# EAGLE schematic electic_sk (EAGLE 9.6.2)
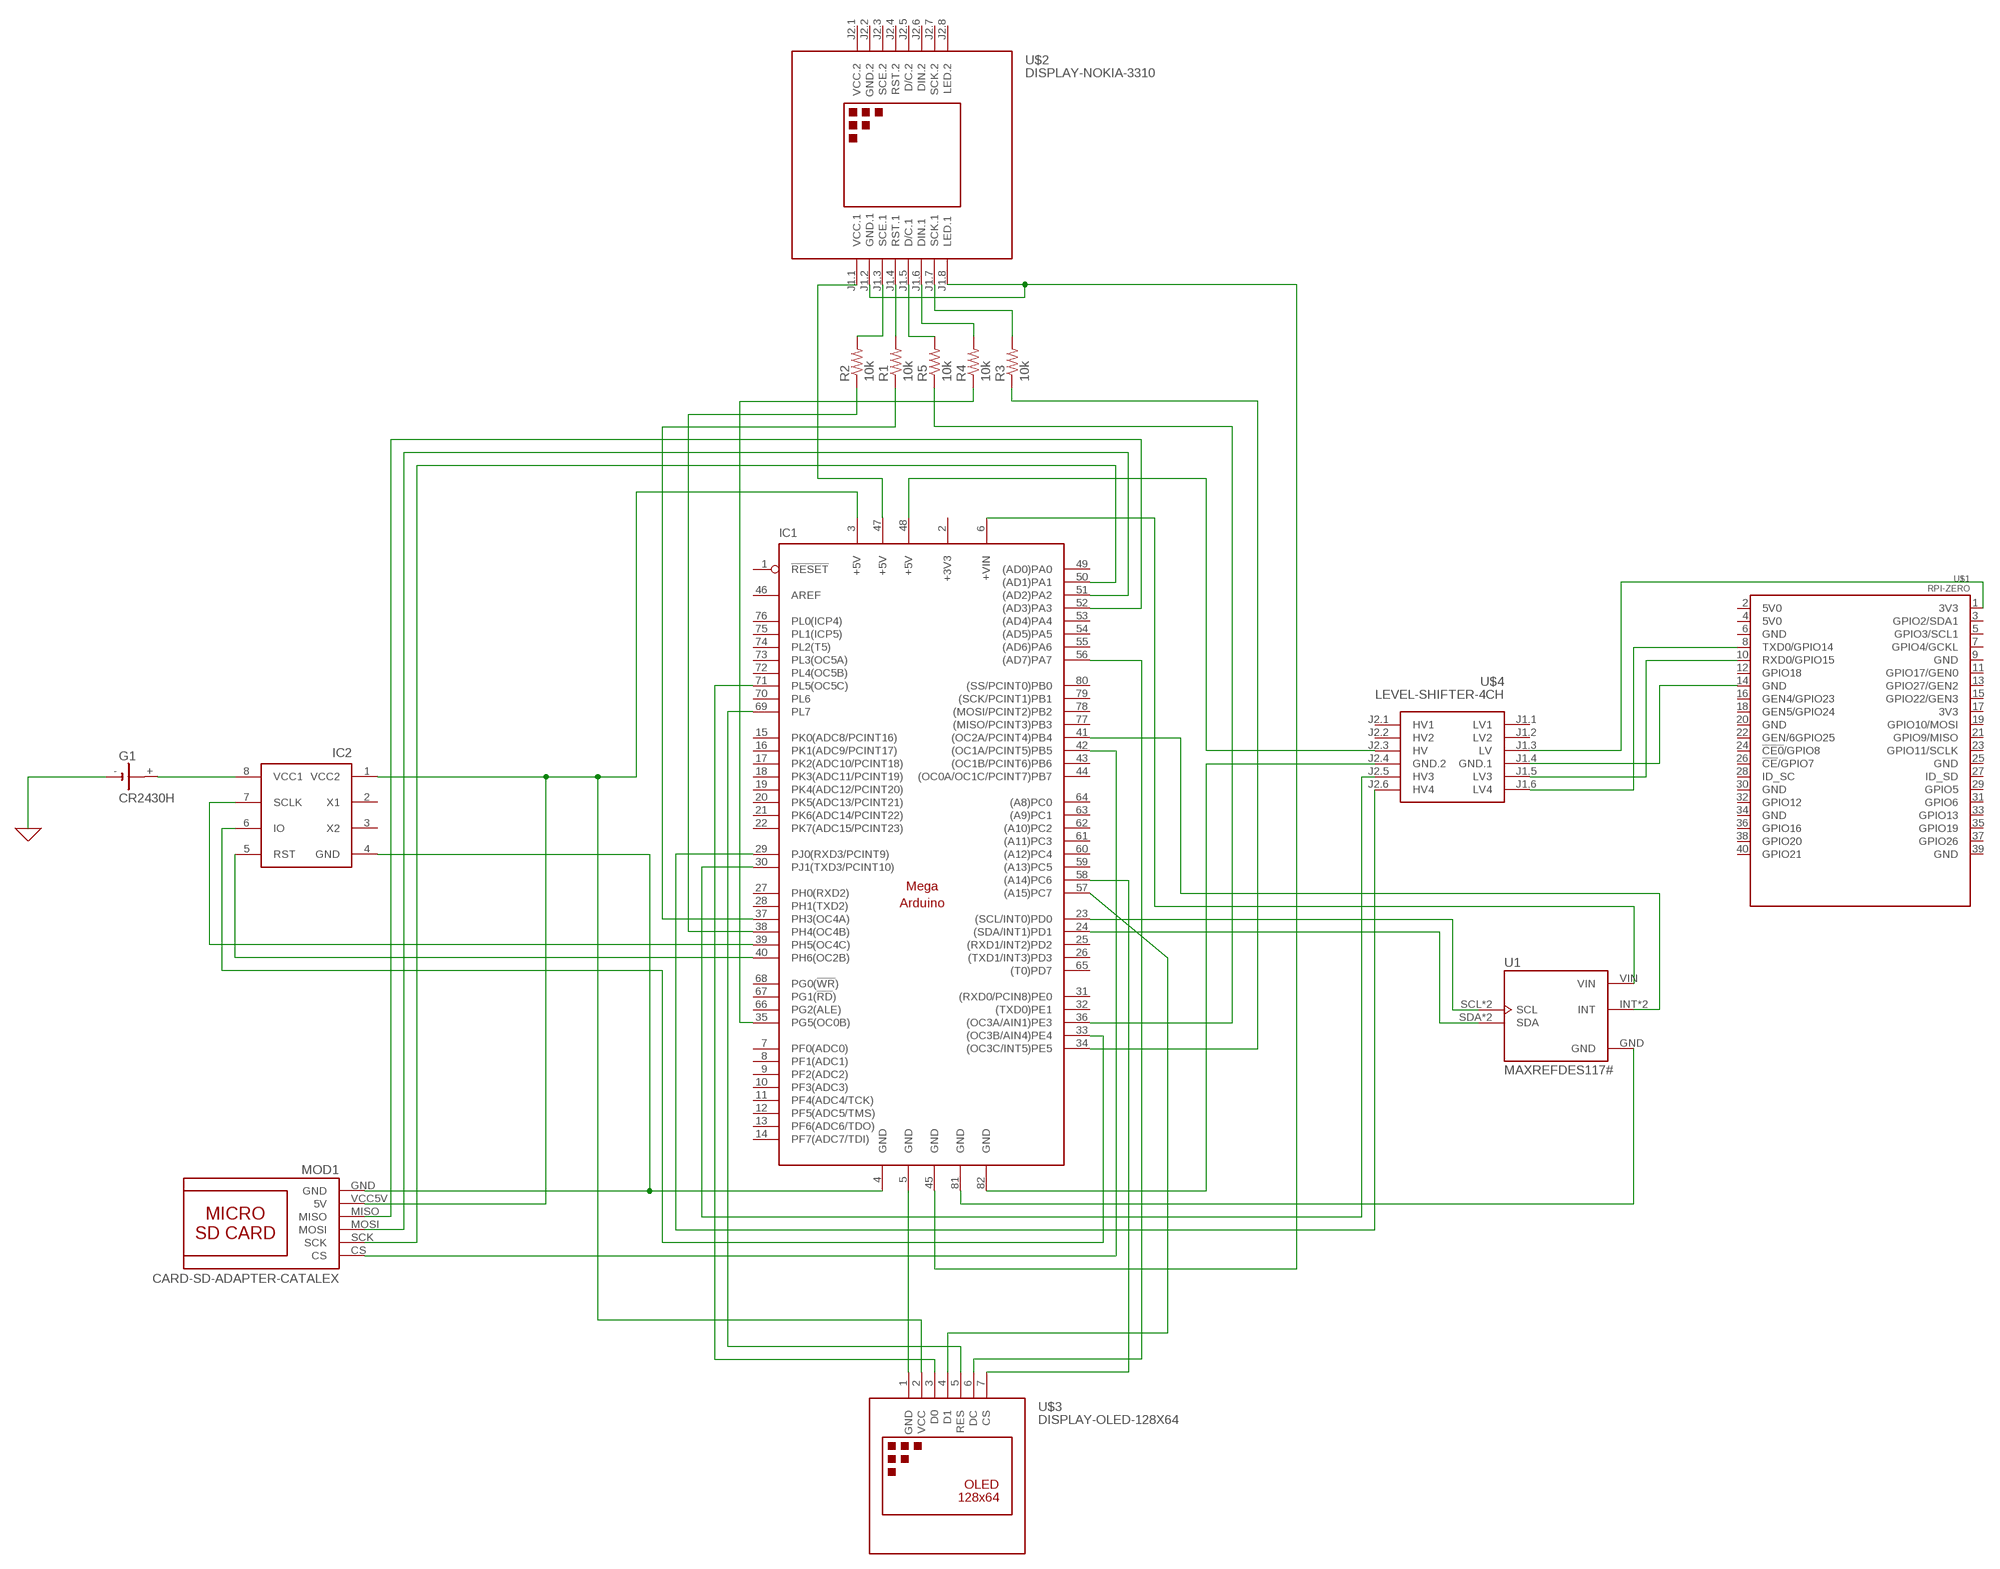
[diagram p0: schematic, sheet 1]

## Parts
G1  CR2430H  [CR2430H]
IC1  MEGAARDUINO_1  [MEGA_ARDUINO]
IC2  DS1302  [PDIP8]
MOD1  CARD-SD-ADAPTER-CATALEX  [CARD-SD-ADAPTER-CATALEX]
R1  10k  R-US_0204/2V  [0204V]
R2  10k  R-US_0204/2V  [0204V]
R3  10k  R-US_0204/2V  [0204V]
R4  10k  R-US_0204/2V  [0204V]
R5  10k  R-US_0204/2V  [0204V]
U1  MAXREFDES117#  [MODULE_MAXREFDES117#]
U$1  RPI-ZERO  [RASPBERRYPI_BASTELSTUBE_V13_RASPI_BOARD_B+_FULL]
U$2  DISPLAY-NOKIA-3310  [DISPLAY-NOKIA-3310]
U$3  DISPLAY-OLED-128X64  [DISPLAY-OLED-128X64]
U$4  LEVEL-SHIFTER-4CH  [LEVEL-SHIFTER-4CH]

## Nets
0: G1.- ; supply symbol labelled GND
3V3@1: U$1.1(3V3) U$4.J1.3(LV)
GND@4: U$1.14(GND) U$4.J1.4(GND.1)
N$1: U$1.10(RXD0/GPIO15) U$4.J1.5(LV3)
N$2: U$1.8(TXD0/GPIO14) U$4.J1.6(LV4)
N$3: IC1.48(+5V) U$4.J2.3(HV)
N$4: IC1.82(GND) U$4.J2.4(GND.2)
N$5: IC1.29(PJ0(RXD3/PCINT9)) U$4.J2.6(HV4)
N$6: IC1.30(PJ1(TXD3/PCINT10)) U$4.J2.5(HV3)
N$7: IC1.23((SCL/INT0)PD0) U1.SCL U1.SCL1(SCL)
N$8: IC1.24((SDA/INT1)PD1) U1.SDA U1.SDA1(SDA)
N$9: IC1.6(+VIN) U1.VIN
N$10: IC1.41((OC2A/PCINT4)PB4) U1.INT U1.INT1(INT)
N$11: IC1.81(GND) U1.GND
N$12: G1.+ IC2.8(VCC1)
N$13: IC1.40(PH6(OC2B)) IC2.5(RST)
N$14: IC1.33((OC3B/AIN4)PE4) IC2.6(IO)
N$15: IC1.4(GND) IC2.4(GND) MOD1.GND
N$16: IC1.39(PH5(OC4C)) IC2.7(SCLK)
N$17: IC1.3(+5V) IC2.1(VCC2) MOD1.VCC5V(5V) U$3.2(VCC)
N$18: IC1.42((OC1A/PCINT5)PB5) MOD1.CS
N$19: IC1.50((AD1)PA1) MOD1.SCK
N$20: IC1.51((AD2)PA2) MOD1.MOSI
N$21: IC1.52((AD3)PA3) MOD1.MISO
N$22: IC1.58((A14)PC6) U$3.7(CS)
N$23: IC1.56((AD7)PA7) U$3.6(DC)
N$24: IC1.69(PL7) U$3.5(RES)
N$25: IC1.57((A15)PC7) U$3.4(D1)
N$26: IC1.71(PL5(OC5C)) U$3.3(D0)
N$27: R1.2 U$2.J1.4(RST.1)
N$28: IC1.5(GND) U$3.1(GND)
N$29: R2.2 U$2.J1.3(SCE.1)
N$30: R5.2 U$2.J1.5(D/C.1)
N$31: R4.2 U$2.J1.6(DIN.1)
N$32: R3.2 U$2.J1.7(SCK.1)
N$33: IC1.38(PH4(OC4B)) R2.1
N$34: IC1.37(PH3(OC4A)) R1.1
N$35: IC1.36((OC3A/AIN1)PE3) R5.1
N$36: IC1.35(PG5(OC0B)) R4.1
N$37: IC1.34((OC3C/INT5)PE5) R3.1
N$38: IC1.45(GND) U$2.J1.2(GND.1) U$2.J1.8(LED.1)
N$40: IC1.47(+5V) U$2.J1.1(VCC.1)
Unconnected: G1.+@1(+) IC1.1(!RESET) IC1.7(PF0(ADC0)) IC1.8(PF1(ADC1)) IC1.9(PF2(ADC2)) IC1.10(PF3(ADC3)) IC1.11(PF4(ADC4/TCK)) IC1.12(PF5(ADC5/TMS)) IC1.13(PF6(ADC6/TDO)) IC1.14(PF7(ADC7/TDI)) IC1.15(PK0(ADC8/PCINT16)) IC1.16(PK1(ADC9/PCINT17)) IC1.17(PK2(ADC10/PCINT18)) IC1.18(PK3(ADC11/PCINT19)) IC1.19(PK4(ADC12/PCINT20)) IC1.20(PK5(ADC13/PCINT21)) IC1.21(PK6(ADC14/PCINT22)) IC1.22(PK7(ADC15/PCINT23)) IC1.25((RXD1/INT2)PD2) IC1.26((TXD1/INT3)PD3) IC1.27(PH0(RXD2)) IC1.28(PH1(TXD2)) IC1.31((RXD0/PCIN8)PE0) IC1.32((TXD0)PE1) IC1.43((OC1B/PCINT6)PB6) IC1.44((OC0A/OC1C/PCINT7)PB7) IC1.46(AREF) IC1.49((AD0)PA0) IC1.53((AD4)PA4) IC1.54((AD5)PA5) IC1.55((AD6)PA6) IC1.59((A13)PC5) IC1.60((A12)PC4) IC1.61((A11)PC3) IC1.62((A10)PC2) IC1.63((A9)PC1) IC1.64((A8)PC0) IC1.65((T0)PD7) IC1.66(PG2(ALE)) IC1.67(PG1(!RD!)) IC1.68(PG0(!WR!)) IC1.70(PL6) IC1.72(PL4(OC5B)) IC1.73(PL3(OC5A)) IC1.74(PL2(T5)) IC1.75(PL1(ICP5)) IC1.76(PL0(ICP4)) IC1.77((MISO/PCINT3)PB3) IC1.78((MOSI/PCINT2)PB2) IC1.79((SCK/PCINT1)PB1) IC1.80((SS/PCINT0)PB0) IC2.2(X1) IC2.3(X2) U$1.2(5V0) U$1.3(GPIO2/SDA1) U$1.4(5V0) U$1.5(GPIO3/SCL1) U$1.6(GND) U$1.7(GPIO4/GCKL) U$1.9(GND) U$1.11(GPIO17/GEN0) U$1.12(GPIO18) U$1.13(GPIO27/GEN2) U$1.15(GPIO22/GEN3) U$1.16(GEN4/GPIO23) U$1.17(3V3) U$1.18(GEN5/GPIO24) U$1.19(GPIO10/MOSI) U$1.20(GND) U$1.21(GPIO9/MISO) U$1.22(GEN/6GPIO25) U$1.23(GPIO11/SCLK) U$1.24(!CE0!/GPIO8) U$1.25(GND) U$1.26(!CE!/GPIO7) U$1.27(ID_SD) U$1.28(ID_SC) U$1.29(GPIO5) U$1.30(GND) U$1.31(GPIO6) U$1.32(GPIO12) U$1.33(GPIO13) U$1.34(GND) U$1.35(GPIO19) U$1.36(GPIO16) U$1.37(GPIO26) U$1.38(GPIO20) U$1.39(GND) U$1.40(GPIO21) U$2.J2.3(SCE.2) U$2.J2.4(RST.2) U$2.J2.5(D/C.2) U$2.J2.6(DIN.2) U$2.J2.7(SCK.2) U$2.J2.8(LED.2) U$4.J1.1(LV1) U$4.J1.2(LV2) U$4.J2.1(HV1) U$4.J2.2(HV2)

## Power pins joined to a net without a drawn wire
+3V3: IC1.2(+3V3)
GND.2: U$2.J2.2(GND.2)
VCC.2: U$2.J2.1(VCC.2)

## Library data of the parts
G1 = battery:CR2430H: LI BATTERY Varta
IC1 = arduino:MEGAARDUINO_1: The Arduino Mega is a microcontroller board based on the ATmega1280. - 54 digital input/output pins (of which 14 can be used as PWM outputs) - 16 analog inputs - 4 UARTs (hardware serial ports) - 16 MHz crystal oscillator - USB connection - power jack - ICSP header - reset button It contains everything needed to support the microcontroller; simply connect it to a computer with a USB cable or power it with a AC-to-DC adapter or battery to get started. The Mega is compatible with most shields designed for the Arduino Duemilanove or Diecimila. http://arduino.cc/en/Main/ArduinoBoardMega
IC2 = ltc1440_lt1529_ds1302:DS1302: DS1302 Realtime Clock The DS1302 trickle-charge timekeeping chip contains a real-time clock/calendar and 31 bytes of static RAM. It communicates with a microprocessor via a simple serial interface. The real-time clock/calendar provides seconds, minutes, hours, day, date, month, and year information. The end of the month date is automatically adjusted for months with fewer than 31 days, including corrections for leap year. The clock operates in either the 24-hour or 12-hour format with an AM/PM indicator. Interfacing the DS1302 with a microprocessor is simplified by using synchronous serial communication. Only three wires are required to communicate with the clock/RAM: CE, I/O (data line), and SCLK (serial clock). Data can be transferred to and from the clock/RAM 1 byte at a time or in a burst of up to 31 bytes. The DS1302 is designed to operate on very low power and retain data and clock information on less than 1µW. The DS1302 is the successor to the DS1202. In addition to the basic timekeeping functions of the DS1202, the DS1302 has the additional features of dual power pins for primary and backup power supplies, programmable trickle charger for VCC1, and seven additional bytes of scratchpad memory.
MOD1 = SD-Card-Module_CATALEX:CARD-SD-ADAPTER-CATALEX: Micro SD Card Adapter Module with onboard 3.3V regulator
R1-R5 = rcl:R-US_: RESISTOR, American symbol; SPICEPREFIX: R
U1 = MAXREFDES117_:MAXREFDES117#: MAX1921, MAX14595, MAX30102 - Medical, Pulse Oximeter (PO or SpO2) Sensor Evaluation Board Check prices <https://pricing.snapeda.com/parts/MAXREFDES117%23/Maxim%20Integrated/view-part?ref=eda>; AVAILABILITY: In Stock; DESCRIPTION: MAX1921, MAX14595, MAX30102 - Medical, Pulse Oximeter (PO or SpO2) Sensor Evaluation Board; MF: Maxim Integrated; MP: MAXREFDES117#; PACKAGE: None; PRICE: None
U$1 = RPI-Zero:RPI-ZERO
U$2 = diy-modules:DISPLAY-NOKIA-3310: 84x48 Dot Matrix LCD Module based on Nokia 3310 display More details available here: https://arduinoandsoftware.wordpress.com/2012/12/30/nokia-33105110-3-3v-display-with-5v-arduino/
U$3 = diy-modules:DISPLAY-OLED-128X64: 128x64 Dot Matrix OLED Module based on SSD1306 chip Variant with SPI interface More details available here: http://www.instructables.com/id/How-to-use-OLED-display-arduino-module/ SSD1306 datasheet: https://cdn-shop.adafruit.com/datasheets/SSD1306.pdf Click here to find device on ebay.com <http://www.ebay.com/sch/oled+display+128x64> Note: There are two variants: I2C and SPI. Search for the proper version.
U$4 = diy-modules:LEVEL-SHIFTER-4CH: 4-Channel Bi-Directional Logic Level Converter based on BSS128 transistors Click here to find device on ebay.com <http://www.ebay.com/sch/i2c+logic+converter+module>